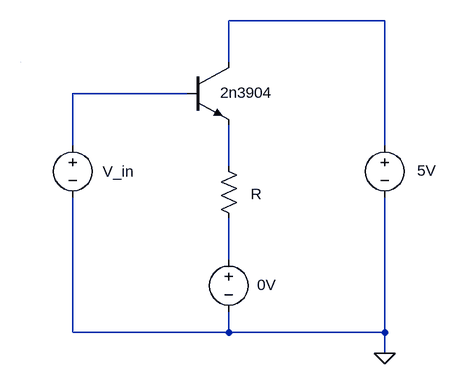
[diagram p0: schematic Experiment 2.asc]
Experiment 2.asc, the LTspice schematic file:
Version 4
SHEET 1 880 680
WIRE 560 -64 320 -64
WIRE 320 0 320 -64
WIRE 256 48 80 48
WIRE 80 128 80 48
WIRE 560 128 560 -64
WIRE 320 160 320 96
WIRE 320 304 320 240
WIRE 80 416 80 208
WIRE 320 416 320 384
WIRE 320 416 80 416
WIRE 560 416 560 208
WIRE 560 416 320 416
WIRE 560 448 560 416
WIRE 0 0 0 0
FLAG 560 448 0
SYMBOL voltage 80 112 R0
WINDOW 0 24 16 Invisible 2
WINDOW 3 46 56 Left 2
SYMATTR InstName V1
SYMATTR Value V_in
SYMBOL voltage 320 288 R0
WINDOW 0 24 16 Invisible 2
WINDOW 3 44 55 Left 2
SYMATTR InstName V2
SYMATTR Value 0V
SYMBOL voltage 560 112 R0
WINDOW 0 24 16 Invisible 2
WINDOW 3 50 55 Left 2
SYMATTR InstName V3
SYMATTR Value 5V
SYMBOL npn 256 0 R0
WINDOW 0 56 32 Invisible 2
WINDOW 3 51 47 Left 2
SYMATTR InstName Q1
SYMATTR Value 2n3904
SYMBOL res 304 144 R0
WINDOW 0 36 40 Invisible 2
WINDOW 3 50 59 Left 2
SYMATTR InstName R1

The netlist it stands for:
* Experiment 2.asc
V1 N002 0 V_in
V2 N004 0 0V
V3 N001 0 5V
Q1 N001 N002 N003 0 2n3904
R1 N003 N004 R
.model NPN NPN
.model PNP PNP
.lib standard.bjt
.backanno
.end